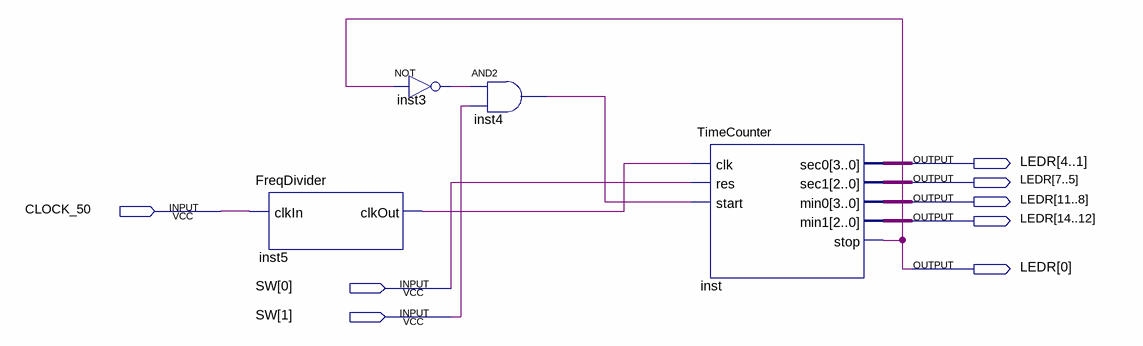
[diagram p0: schematic sheet]
// Quartus schematic Fase1.bdf as structural Verilog: 4 symbols, 8 pins
module Fase1 (
  input  CLOCK_50,
  input  [1:0] SW,
  output [14:0] LEDR
);

  wire inst3_out, inst4_out, inst5_clkout;

  FreqDivider inst5 (.clkIn(CLOCK_50), .clkOut(inst5_clkout));
  not inst3 (inst3_out, LEDR[0]);
  and inst4 (inst4_out, inst3_out, SW[1]);
  TimeCounter inst (
    .clk(inst5_clkout), .res(SW[0]), .start(inst4_out), .sec0(LEDR[4:1]), .sec1(LEDR[7:5]),
    .min0(LEDR[11:8]), .min1(LEDR[14:12]), .stop(LEDR[0]));
endmodule
